# Altium schematic sheet FPGA_51_Keyboard.SchDoc
size B; Organization: Altium Limited; Address1: L3, 12a Rodborough Rd; Address2: Frenchs Forest; Address3: NSW; Address4: Australia 2086; DocumentNumber: 1; SheetNumber: 1; SheetTotal: 2
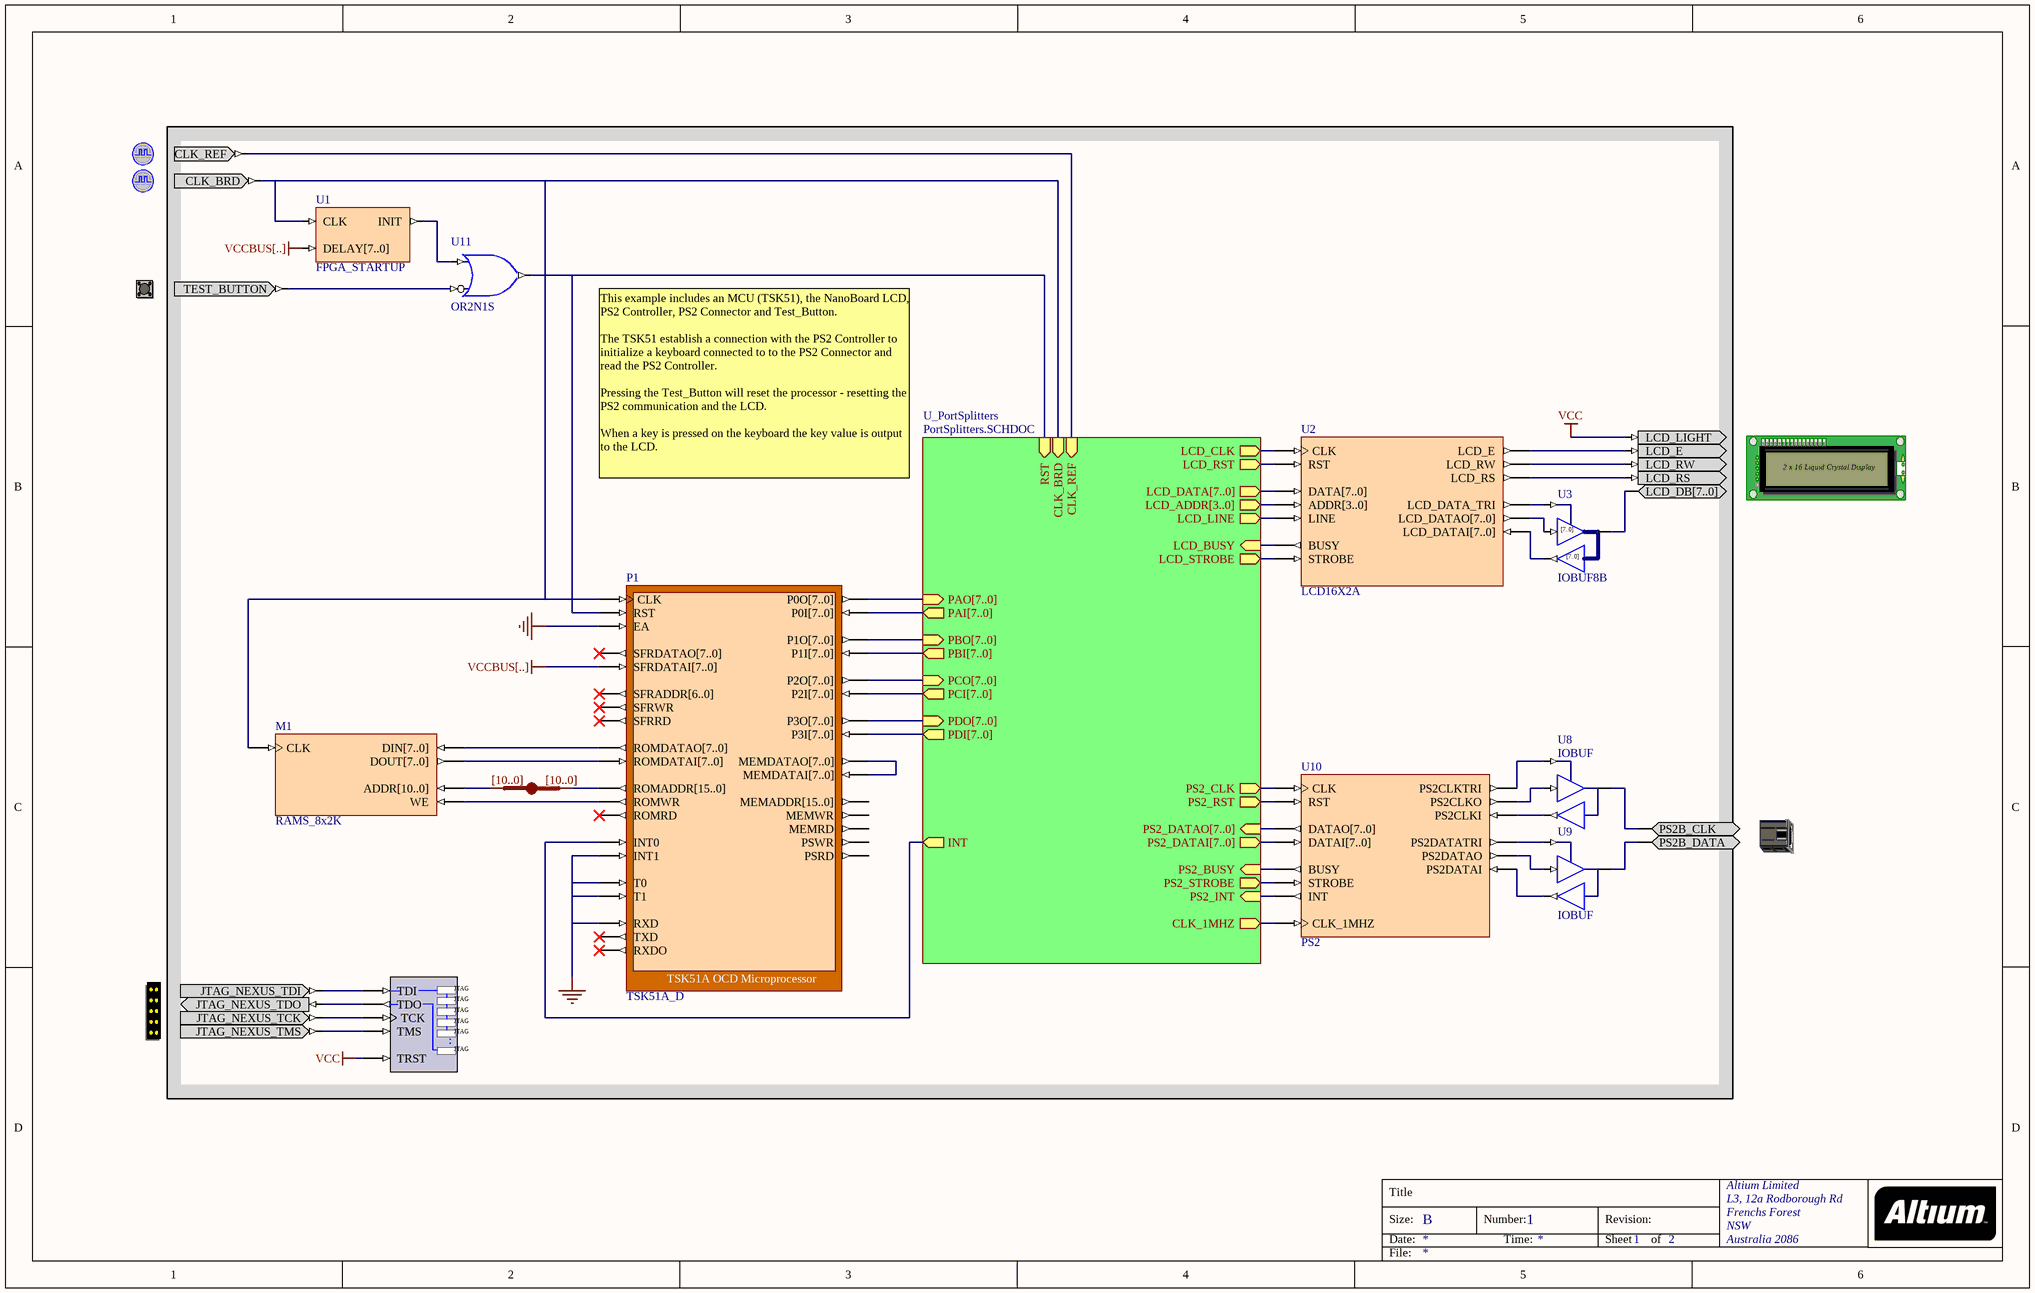
[diagram p0: FPGA_51_Keyboard.SchDoc]

## Parts
(Parts that share a designator on the sheet are numbered #1, #2 ... from top to bottom, then left to right.)
?#1  CLOCK_REFERENCE  (value not drawn)
?#2  CLOCK_BOARD  (value not drawn)
?#3  TEST_BUTTON  (value not drawn)
?#4  LCD  (value not drawn)
?#5  PS2B  (value not drawn)
?#6  NEXUS_JTAG_CONNECTOR  (value not drawn)
JB1  IndexA: [10..0]  (hidden comment: JB)
M1  RAMS_8x2K
NEXUS_JTAG_PORT  NEXUS_JTAG_PORT  (value not drawn)
P1  TSK51A_D
U1  FPGA_STARTUP
U2  LCD16X2A
U3  IOBUF8B
U8  IOBUF
U9  IOBUF
U10  PS2
U11  OR2N1S

## Sub-sheets
U_PortSplitters = PortSplitters.SCHDOC: PAO[7..0] (in), PBO[7..0] (in), PCO[7..0] (in), PDO[7..0] (in), PAI[7..0] (out), PBI[7..0] (out), PCI[7..0] (out), PDI[7..0] (out), LCD_DATA[7..0] (out), LCD_ADDR[3..0] (out), LCD_LINE (out), LCD_STROBE (out), LCD_BUSY (in), PS2_DATAI[7..0] (out), PS2_BUSY (in), PS2_STROBE (out), PS2_INT (in), INT (out), CLK_1MHZ (out), CLK_REF (in), CLK_BRD (in), RST (in), PS2_CLK (out), PS2_RST (out), LCD_RST (out), LCD_CLK (out), PS2_DATAO[7..0] (in)

## Nets
GND: P1.EA P1.INT1 P1.RXD P1.T0 P1.T1
VCC: ?#4.LCD_LIGHT NEXUS_JTAG_PORT.TRST
VCCBUS[..]: P1.SFRDATAI[7..0] U1.DELAY[7..0]
Net?#1_CLK_REF: ?#1.CLK_REF ; sheet U_PortSplitters/CLK_REF
Net?#2_CLK_BRD: ?#2.CLK_BRD M1.CLK P1.CLK U1.CLK ; sheet U_PortSplitters/CLK_BRD
Net?#3_TEST_BUTTON: ?#3.TEST_BUTTON U11.I0
Net?#4_LCD_DB[7..0]: ?#4.LCD_DB[7..0] U3.IO[7..0]
Net?#4_LCD_E: ?#4.LCD_E U2.LCD_E
Net?#4_LCD_RS: ?#4.LCD_RS U2.LCD_RS
Net?#4_LCD_RW: ?#4.LCD_RW U2.LCD_RW
Net?#5_PS2B_CLK: ?#5.PS2B_CLK U8.IO
Net?#5_PS2B_DATA: ?#5.PS2B_DATA U9.IO
Net?#6_JTAG_NEXUS_TCK: ?#6.JTAG_NEXUS_TCK NEXUS_JTAG_PORT.TCK
Net?#6_JTAG_NEXUS_TDI: ?#6.JTAG_NEXUS_TDI NEXUS_JTAG_PORT.TDI
Net?#6_JTAG_NEXUS_TDO: ?#6.JTAG_NEXUS_TDO NEXUS_JTAG_PORT.TDO
Net?#6_JTAG_NEXUS_TMS: ?#6.JTAG_NEXUS_TMS NEXUS_JTAG_PORT.TMS
NetJB1_A[0..0]: JB1.A[0..0] M1.ADDR[10..0]
NetJB1_B[0..0]: JB1.B[0..0] P1.ROMADDR[15..0]
NetM1_DIN[7..0]: M1.DIN[7..0] P1.ROMDATAO[7..0]
NetM1_DOUT[7..0]: M1.DOUT[7..0] P1.ROMDATAI[7..0]
NetM1_WE: M1.WE P1.ROMWR
NetP1_INT0: P1.INT0 ; sheet U_PortSplitters/INT
NetP1_MEMDATAI[7..0]: P1.MEMDATAI[7..0] P1.MEMDATAO[7..0]
NetP1_P0I[7..0]: P1.P0I[7..0] ; sheet U_PortSplitters/PAI[7..0]
NetP1_P0O[7..0]: P1.P0O[7..0] ; sheet U_PortSplitters/PAO[7..0]
NetP1_P1I[7..0]: P1.P1I[7..0] ; sheet U_PortSplitters/PBI[7..0]
NetP1_P1O[7..0]: P1.P1O[7..0] ; sheet U_PortSplitters/PBO[7..0]
NetP1_P2I[7..0]: P1.P2I[7..0] ; sheet U_PortSplitters/PCI[7..0]
NetP1_P2O[7..0]: P1.P2O[7..0] ; sheet U_PortSplitters/PCO[7..0]
NetP1_P3I[7..0]: P1.P3I[7..0] ; sheet U_PortSplitters/PDI[7..0]
NetP1_P3O[7..0]: P1.P3O[7..0] ; sheet U_PortSplitters/PDO[7..0]
NetP1_RST: P1.RST U11.O ; sheet U_PortSplitters/RST
NetU1_INIT: U1.INIT U11.I1
NetU2_ADDR[3..0]: U2.ADDR[3..0] ; sheet U_PortSplitters/LCD_ADDR[3..0]
NetU2_BUSY: U2.BUSY ; sheet U_PortSplitters/LCD_BUSY
NetU2_CLK: U2.CLK ; sheet U_PortSplitters/LCD_CLK
NetU2_DATA[7..0]: U2.DATA[7..0] ; sheet U_PortSplitters/LCD_DATA[7..0]
NetU2_LCD_DATA_TRI: U2.LCD_DATA_TRI U3.T
NetU2_LCD_DATAI[7..0]: U2.LCD_DATAI[7..0] U3.O[7..0]
NetU2_LCD_DATAO[7..0]: U2.LCD_DATAO[7..0] U3.I[7..0]
NetU2_LINE: U2.LINE ; sheet U_PortSplitters/LCD_LINE
NetU2_RST: U2.RST ; sheet U_PortSplitters/LCD_RST
NetU2_STROBE: U2.STROBE ; sheet U_PortSplitters/LCD_STROBE
NetU8_I: U8.I U10.PS2CLKO
NetU8_O: U8.O U10.PS2CLKI
NetU8_T: U8.T U10.PS2CLKTRI
NetU9_I: U9.I U10.PS2DATAO
NetU9_O: U9.O U10.PS2DATAI
NetU9_T: U9.T U10.PS2DATATRI
NetU10_BUSY: U10.BUSY ; sheet U_PortSplitters/PS2_BUSY
NetU10_CLK: U10.CLK ; sheet U_PortSplitters/PS2_CLK
NetU10_CLK_1MHZ: U10.CLK_1MHZ ; sheet U_PortSplitters/CLK_1MHZ
NetU10_DATAI[7..0]: U10.DATAI[7..0] ; sheet U_PortSplitters/PS2_DATAI[7..0]
NetU10_DATAO[7..0]: U10.DATAO[7..0] ; sheet U_PortSplitters/PS2_DATAO[7..0]
NetU10_INT: U10.INT ; sheet U_PortSplitters/PS2_INT
NetU10_RST: U10.RST ; sheet U_PortSplitters/PS2_RST
NetU10_STROBE: U10.STROBE ; sheet U_PortSplitters/PS2_STROBE

Not connected (* = marked no-connect by the designer): P1 MEMADDR[15..0] MEMRD MEMWR PSRD PSWR ROMRD* RXDO* SFRADDR[6..0]* SFRDATAO[7..0]* SFRRD* SFRWR* TXD*

## Notes on the sheet
- This example includes an MCU (TSK51), the NanoBoard LCD, PS2 Controller, PS2 Connector and Test_Button.
  The TSK51 establish a connection with the PS2 Controller to initialize a keyboard connected to to the PS2 Connector and read the PS2 Controller.
  Pressing the Test_Button will reset the processor - resetting the PS2 communication and the LCD.
  When a key is pressed on the keyboard the key value is output to the LCD.
- Title
- Size:
- Date:
- B
- Number:
- Time:
- Revision:
- Sheet
- of
- File:
- (in symbol IOBUF8B) [7..0]
- (in symbol LCD) 2 x 16 Liquid Crystal Display
- (in symbol NEXUS_JTAG_PORT) JTAG; .

## Library data of the parts
?#1 = CLOCK_REFERENCE: Global System Clock Reference Supply; PortComponent: True; Published: 19-Nov-2003; Publisher: Altium Limited
?#2 = CLOCK_BOARD: Global System Clock Supply; PortComponent: True; Published: 19-Nov-2003; Publisher: Altium Limited
?#3 = TEST_BUTTON: Test Button; PortComponent: True; Published: 19-Nov-2003; Publisher: Altium Limited
?#4 = LCD: Liquid Crystal Display; PortComponent: True; Published: 19-Nov-2003; Publisher: Altium Limited
?#5 = PS2B: Key Board PS2 Connector; PortComponent: True; Published: 19-Nov-2003; Publisher: Altium Limited
?#6 = NEXUS_JTAG_CONNECTOR: JTAG Port; PortComponent: True; Published: 19-Nov-2003; Publisher: Altium Limited
JB1 = JB: System BUS Joiner; ArchiveName: GENERIC; Published: 18-Dec-2003; Publisher: Altium Limited; Core Revision: 1.00.00; IndexB: [10..0]
M1 = RAMS_8x2K: Single Port Random Access Memory; Memory_Depth: 2048; Memory_Type: RAM_SinglePortBlock; Memory_Width: 8; Memory_ClockEdge: Rising; Nexus_Core: Memory_Program; Published: 13/01/2004; Publisher: Altium Hobart Technology Center
NEXUS_JTAG_PORT = NEXUS_JTAG_PORT: Soft Nexus-Chain Connector; NEXUS_JTAG_CONNECTOR: True; Published: 18-Dec-2003; Publisher: Altium Limited
P1 = TSK51A_D: TSK51A OCD Microprocessor; NEXUS_CORE: Processor_OCDS; NEXUS_JTAG_DEVICE: True; NEXUS_JTAG_ORDER: 0; ChildModel1: RAM256x8_TSK51D; ChildCore1: M1; Memory_Configuration: Record[NEXUS_CORE]{}ComponentDesignator[iram]{}Memory_Depth[256]{}Memory_UsageType[ram]{}ProgramDownloadAddress[0x0]{}Memory_BusType[c51:idata_bus]{n}Record[NEXUS_CORE]{}ComponentDesignator[xram]{}Memory_Depth[64k]{}Memory_UsageType[ram]{}ProgramDownloadAddress[0x0]{}Memory_BusType[c51:xdata_bus]{n}Record[NEXUS_CORE]{}ComponentDesignator[xrom]{}Memory_Depth[64k]{}Memory_UsageType[rom]{}ProgramDownloadAddress[0x0]{}Memory_BusType[c51:code_bus]{n}; Published: 10/11/2003; Publisher: Altium Hobart Technology Centre; Core Revision: 1.00.00
U1 = FPGA_STARTUP8: FPGA Startup With 8 Bit Delay; Published: 21/01/2004; Publisher: Altium Hobart Technology Centre; Core Revision: 1.00.00
U2 = LCD16X2A: LCD Controller; Published: 5/01/2004; Publisher: Altium Hobart Technology Centre; Core Revision: 1.00.00
U3 = IOBUF8B: 8-Bit Input/Output Buffer, Bus Version; ArchiveName: GENERIC; Published: 18-Dec-2003; Publisher: Altium Limited; Core Revision: 1.00.00
U8 U9 = IOBUF: Input/Output Buffer; ArchiveName: GENERIC; Published: 18-Nov-2003; Publisher: Altium Limited; Xilinx Equivalent: IOBUF; Core Revision: 1.00.00
U10 = PS2: PS2 Controller; Published: 3/02/2004; Publisher: Altium Hobart Technology Centre; Core Revision: 1.00.00
U11 = OR2N1S: 2-Input OR Gate with Active Low A Input, Single Pin Version; Xilinx Equivalent: OR2B1; ArchiveName: GENERIC; Published: 18-Dec-2003; Publisher: Altium Limited; Core Revision: 1.00.00